# Altium schematic sheet MB_Conn.SchDoc
size 420 x 297 mm; Date: 18/12/2022; ApprovedBy: UA3REO; CheckedBy: UA3REO; Author: RU4PN; CompanyName: Wolf Teams; DocumentNumber: Wolf2 MainBoard Connections; Revision: 0.2; SheetNumber: 1; SheetTotal: 7
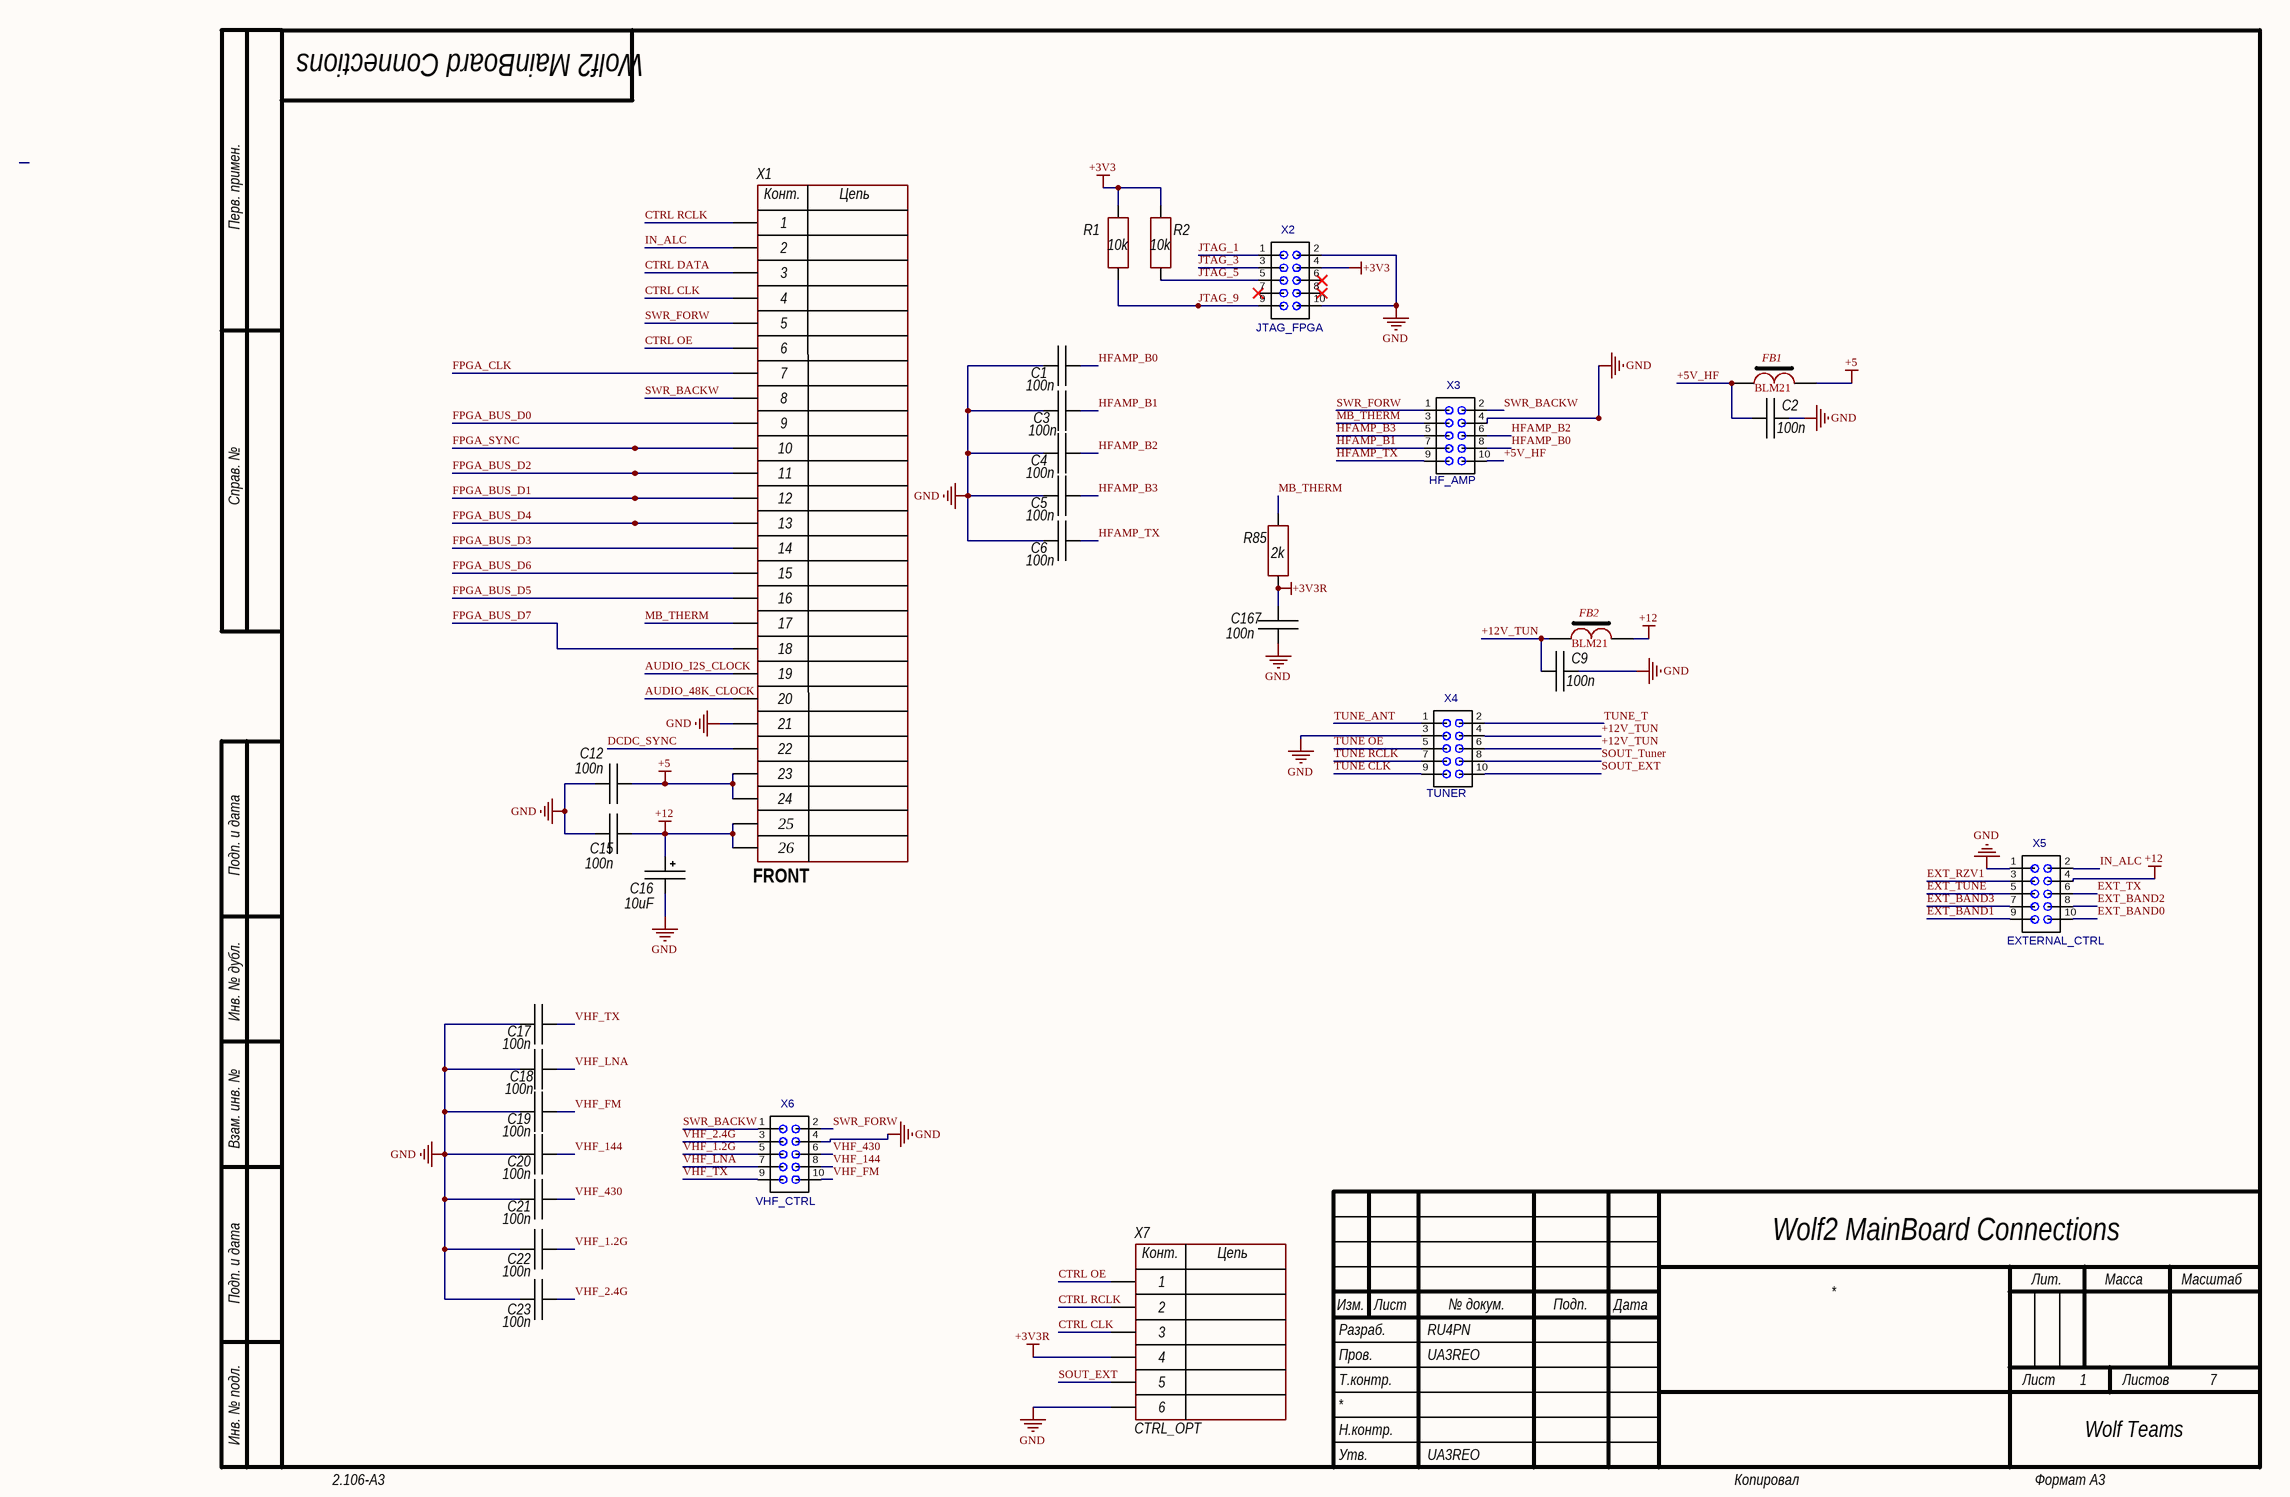
[diagram p0: MB_Conn.SchDoc]

## Parts
C1  100n  [CH0805C]
C2  100n  [CH0805C]
C3  100n  [CH0805C]
C4  100n  [CH0805C]
C5  100n  [CH0805C]
C6  100n  [CH0805C]
C9  100n  [CH0805C]
C12  100n  [CH0805C]
C15  100n  [CH0805C]
C16  10uF  [TANTAL_B]
C17  100n  [CH0805C]
C18  100n  [CH0805C]
C19  100n  [CH0805C]
C20  100n  [CH0805C]
C21  100n  [CH0805C]
C22  100n  [CH0805C]
C23  100n  [CH0805C]
C167  100n  [CH0805C]
FB1  BLM21  [CH0805L]
FB2  BLM21  [CH0805L]
R1  10k  [CH0805R]
R2  10k  [CH0805R]
R85  2k  [CH0805R]
X1  FRONT  [CON: IDC-26]
X2  JTAG_FPGA  [CON: BH-10]
X3  HF_AMP  [CON: BH-10]
X4  TUNER  [CON: BH-10]
X5  EXTERNAL_CTRL  [CON: BH-10]
X6  VHF_CTRL  [CON: BH-10]
X7  CTRL_OPT  [CON: PBS-6]

## Nets
+3V3: R1.2 R2.2 X2.4
+3V3R: C167.2 R85.1 X7.4
+5: C12.1 FB1.1 X1.23 X1.24
+12: C15.1 C16.1 FB2.1 X1.25 X1.26 X5.4
GND: C1.2 C2.2 C3.2 C4.2 C5.2 C6.2 C9.2 C12.2 C15.2 C16.2 C17.2 C18.2 C19.2 C20.2 C21.2 C22.2 C23.2 C167.1 X1.21 X2.2 X2.10 X3.4 X4.3 X5.1 X6.4 X7.6
+5V_HF: C2.1 FB1.2 X3.10
+12V_TUN: C9.1 FB2.2 X4.4 X4.6
AUDIO_48K_CLOCK: X1.20
AUDIO_I2S_CLOCK: X1.19
CTRL CLK: X1.4 X7.3
CTRL DATA: X1.3
CTRL OE: X1.6 X7.1
CTRL RCLK: X1.1 X7.2
DCDC_SYNC: X1.22
EXT_BAND0: X5.10
EXT_BAND1: X5.9
EXT_BAND2: X5.8
EXT_BAND3: X5.7
EXT_RZV1: X5.3
EXT_TUNE: X5.5
EXT_TX: X5.6
FPGA_BUS_D0: X1.9
FPGA_BUS_D1: X1.12
FPGA_BUS_D2: X1.11
FPGA_BUS_D3: X1.14
FPGA_BUS_D4: X1.13
FPGA_BUS_D5: X1.16
FPGA_BUS_D6: X1.15
FPGA_BUS_D7: X1.18
FPGA_CLK: X1.7
FPGA_SYNC: X1.10
HFAMP_B0: C1.1 X3.8
HFAMP_B1: C3.1 X3.7
HFAMP_B2: C4.1 X3.6
HFAMP_B3: C5.1 X3.5
HFAMP_TX: C6.1 X3.9
IN_ALC: X1.2 X5.2
JTAG_1: X2.1
JTAG_3: X2.3
JTAG_5: R2.1 X2.5
JTAG_9: R1.1 X2.9
MB_THERM: R85.2 X1.17 X3.3
SOUT_EXT: X4.10 X7.5
SOUT_Tuner: X4.8
SWR_BACKW: X1.8 X3.2 X6.1
SWR_FORW: X1.5 X3.1 X6.2
TUNE CLK: X4.9
TUNE OE: X4.5
TUNE RCLK: X4.7
TUNE_ANT: X4.1
TUNE_T: X4.2
VHF_1.2G: C22.1 X6.5
VHF_2.4G: C23.1 X6.3
VHF_144: C20.1 X6.8
VHF_430: C21.1 X6.6
VHF_FM: C19.1 X6.10
VHF_LNA: C18.1 X6.7
VHF_TX: C17.1 X6.9

Not connected (* = marked no-connect by the designer): X2 6* 7* 8*

## Notes on the sheet
- Перв. примен.
- Справ. №
- Подп. и дата
- Инв. № дубл.
- Взам. инв. №
- Разраб.
- Изм.
- Лист
- № докум.
- Подп.
- Дата
- Лит.
- Масса
- Масштаб
- Пров.
- Т.контр.
- Листов
- Инв. № подл.
- Утв.
- Н.контр.
- 2.106-A3
- Копировал
- Формат А3
- (in symbol 6-Connector) Конт.; Цепь
- (in symbol 26-Connector) Конт.; Цепь

## Library data of the parts
C1-C6 C9 C12 C15 C17-C23 C167 = Capacitor: Manufacturer: *; Model: *; HelpURL: *; ComponentKind: *; Value: *
C16 = TantalCap: Manufacturer: *; Model: *; HelpURL: *; ComponentKind: *; Value: *
FB1 FB2 = FB-1
R1 R2 R85 = Resistor: Manufacturer: *; Model: *; HelpURL: *; ComponentKind: *; Value: *
X1 = 26-Connector: Model: *; Manufacturer: *; HelpURL: *; ComponentKind: *
X2-X6 = IDC10: 2*5 Pin
X7 = 6-Connector: Model: *; Manufacturer: *; HelpURL: *; ComponentKind: *